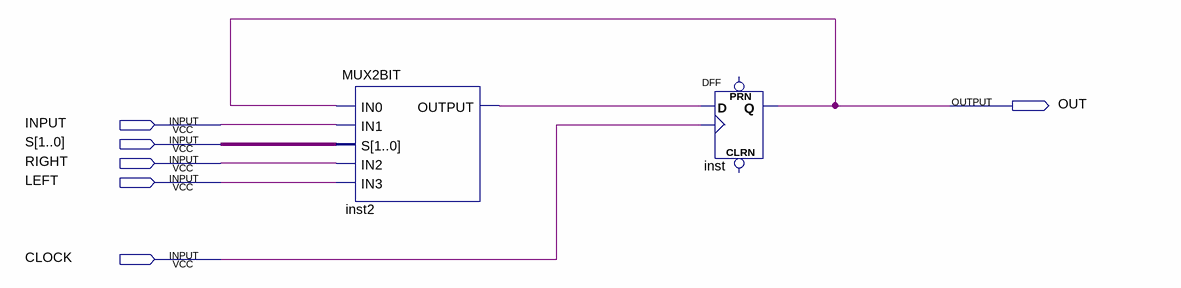
[diagram p0: schematic sheet]
// Quartus schematic ShiftRegister1BIT.bdf as structural Verilog: 2 symbols, 6 pins
module ShiftRegister1BIT (
  input  INPUT,
  input  [1:0] S,
  input  RIGHT,
  input  LEFT,
  input  CLOCK,
  output OUT
);

  wire inst2_output;

  MUX2BIT inst2 (.IN0(OUT), .IN1(INPUT), .S(S), .IN2(RIGHT), .IN3(LEFT), .OUTPUT(inst2_output));
  DFF inst (.CLK(CLOCK), .D(inst2_output), .Q(OUT));  // open: CLRN, PRN
endmodule
